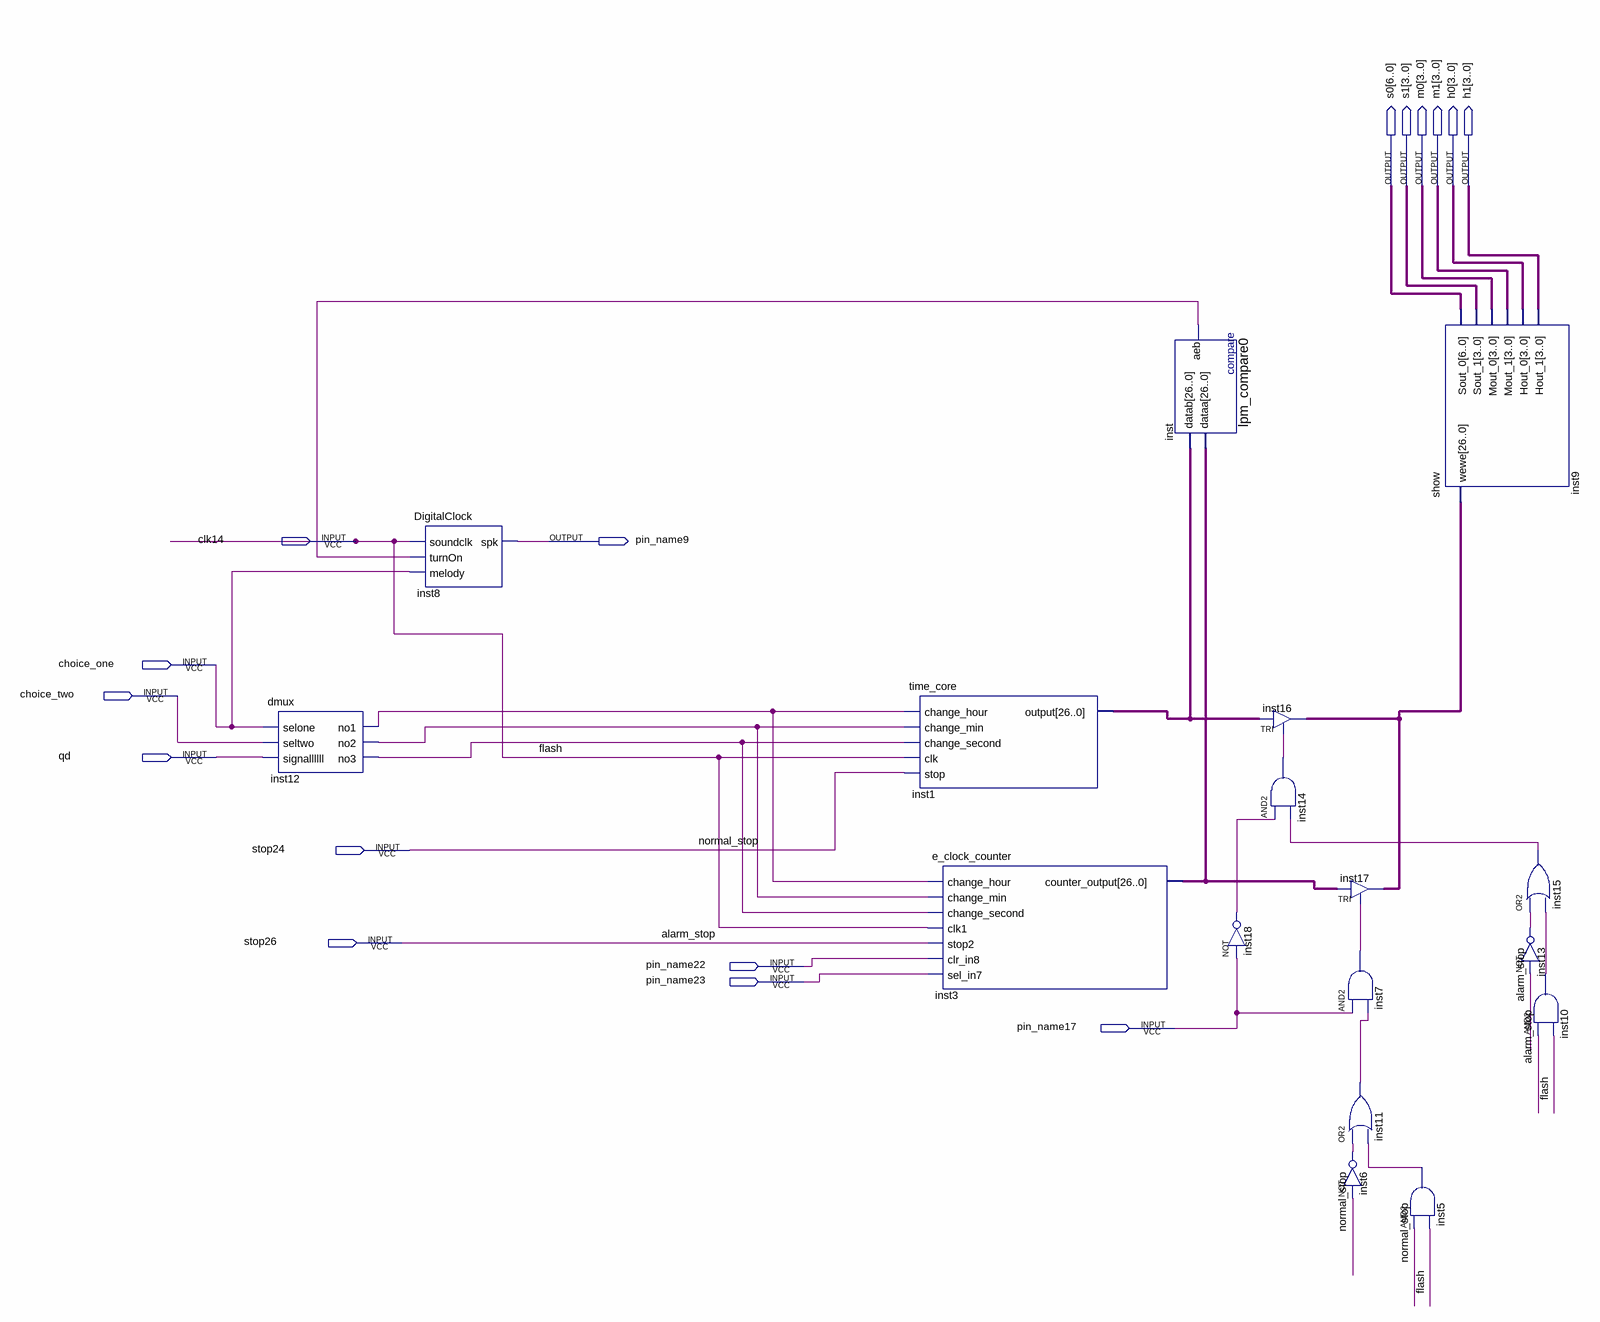
[diagram p0: schematic sheet]
// Quartus schematic Block1.bdf as structural Verilog: 17 symbols, 16 pins
module Block1 (
  input  clk14,
  input  choice_one,
  input  choice_two,
  input  qd,
  input  stop24,
  input  stop26,
  input  pin_name22,
  input  pin_name23,
  input  pin_name17,
  output [6:0] s0,
  output [3:0] s1,
  output [3:0] m0,
  output [3:0] m1,
  output [3:0] h0,
  output [3:0] h1,
  output pin_name9
);

  wire inst5_out, inst6_out, inst7_out, inst10_out, inst11_out, inst12_no1, inst12_no2, inst12_no3,
       inst13_out, inst14_out, inst15_out, inst18_out, inst_aeb;
  wire [26:0] inst1_output, inst3_counter_output, inst16_out;

  dmux inst12 (
    .selone(choice_one), .seltwo(choice_two), .signallllll(qd), .no1(inst12_no1), .no2(inst12_no2),
    .no3(inst12_no3));
  DigitalClock inst8 (.soundclk(clk14), .turnOn(inst_aeb), .melody(choice_one), .spk(pin_name9));
  time_core inst1 (
    .change_hour(inst12_no1), .change_min(inst12_no2), .change_second(inst12_no3), .clk(clk14),
    .stop(stop24), .\output (inst1_output));
  e_clock_counter inst3 (
    .change_hour(inst12_no1), .change_min(inst12_no2), .change_second(inst12_no3), .clk1(clk14),
    .stop2(stop26), .clr_in8(pin_name22), .sel_in7(pin_name23), .counter_output(inst3_counter_output));
  lpm_compare0 inst (.dataa(inst3_counter_output), .datab(inst1_output), .aeb(inst_aeb));
  TRI inst16[26:0] (.IN(inst1_output), .OE(inst14_out), .OUT(inst16_out));
  and inst14 (inst14_out, inst18_out, inst15_out);
  not inst18 (inst18_out, pin_name17);
  TRI inst17[26:0] (.IN(inst3_counter_output), .OE(inst7_out), .OUT(inst16_out));
  and inst7 (inst7_out, pin_name17, inst11_out);
  or inst11 (inst11_out, inst6_out, inst5_out);
  not inst6 (inst6_out, stop24);
  show inst9 (.wewe(inst16_out), .Sout_0(s0), .Sout_1(s1), .Mout_0(m0), .Mout_1(m1), .Hout_0(h0), .Hout_1(h1));
  and inst5 (inst5_out, stop24, clk14);
  or inst15 (inst15_out, inst13_out, inst10_out);
  not inst13 (inst13_out, stop26);
  and inst10 (inst10_out, stop26, clk14);

  // Other names for the same wires on the sheet: alarm_stop = stop26; flash = clk14; normal_stop = stop24
endmodule
